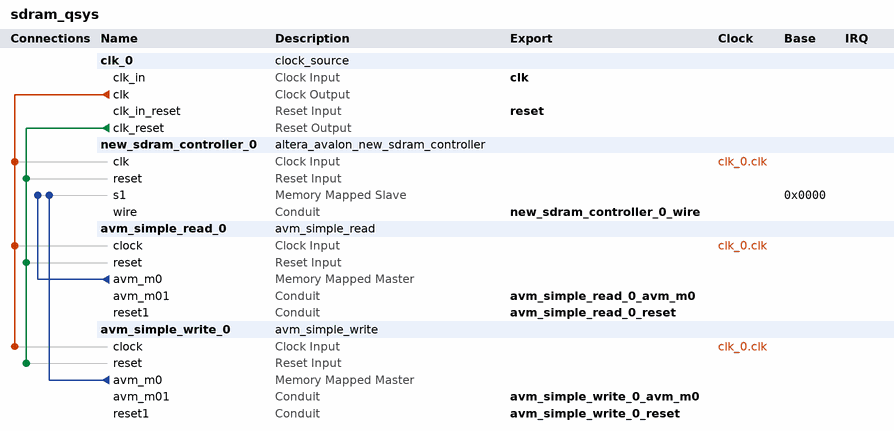
[diagram p0: system contents]
# Platform Designer (Qsys) system sdram_qsys, MAX 10 10M50DAF484C7G
# Parameters at their usual value, and those the tool derives, are not listed.
package require -exact qsys 17.1
create_system sdram_qsys
set_project_property DEVICE_FAMILY {MAX 10}
set_project_property DEVICE 10M50DAF484C7G

add_instance clk_0 clock_source 17.1
set_instance_parameter_value clk_0 clockFrequency 50000000

add_instance new_sdram_controller_0 altera_avalon_new_sdram_controller 17.1
set_instance_parameter_value new_sdram_controller_0 TAC 5.5
set_instance_parameter_value new_sdram_controller_0 TRCD 20.0
set_instance_parameter_value new_sdram_controller_0 TRP 20.0
set_instance_parameter_value new_sdram_controller_0 casLatency 3
set_instance_parameter_value new_sdram_controller_0 columnWidth 10
set_instance_parameter_value new_sdram_controller_0 dataWidth 16
set_instance_parameter_value new_sdram_controller_0 generateSimulationModel false
set_instance_parameter_value new_sdram_controller_0 model single_Micron_MT48LC4M32B2_7_chip
set_instance_parameter_value new_sdram_controller_0 numberOfBanks 4
set_instance_parameter_value new_sdram_controller_0 numberOfChipSelects 1
set_instance_parameter_value new_sdram_controller_0 powerUpDelay 100.0
set_instance_parameter_value new_sdram_controller_0 refreshPeriod 15.625
set_instance_parameter_value new_sdram_controller_0 rowWidth 13

add_instance avm_simple_read_0 avm_simple_read 1.0

add_instance avm_simple_write_0 avm_simple_write 1.0

# connections
add_connection clk_0.clk avm_simple_read_0.clock clock
add_connection clk_0.clk avm_simple_write_0.clock clock
add_connection clk_0.clk new_sdram_controller_0.clk clock
add_connection clk_0.clk_reset avm_simple_read_0.reset reset
add_connection clk_0.clk_reset avm_simple_write_0.reset reset
add_connection clk_0.clk_reset new_sdram_controller_0.reset reset
add_connection avm_simple_read_0.avm_m0 new_sdram_controller_0.s1 avalon
set_connection_parameter_value avm_simple_read_0.avm_m0/new_sdram_controller_0.s1 baseAddress 0x0000
add_connection avm_simple_write_0.avm_m0 new_sdram_controller_0.s1 avalon
set_connection_parameter_value avm_simple_write_0.avm_m0/new_sdram_controller_0.s1 baseAddress 0x0000

# exported interfaces
add_interface avm_simple_read_0_avm_m0 conduit end
set_interface_property avm_simple_read_0_avm_m0 EXPORT_OF avm_simple_read_0.avm_m01
add_interface avm_simple_read_0_reset conduit end
set_interface_property avm_simple_read_0_reset EXPORT_OF avm_simple_read_0.reset1
add_interface avm_simple_write_0_avm_m0 conduit end
set_interface_property avm_simple_write_0_avm_m0 EXPORT_OF avm_simple_write_0.avm_m01
add_interface avm_simple_write_0_reset conduit end
set_interface_property avm_simple_write_0_reset EXPORT_OF avm_simple_write_0.reset1
add_interface clk clock sink
set_interface_property clk EXPORT_OF clk_0.clk_in
add_interface new_sdram_controller_0_wire conduit end
set_interface_property new_sdram_controller_0_wire EXPORT_OF new_sdram_controller_0.wire
add_interface reset reset sink
set_interface_property reset EXPORT_OF clk_0.clk_in_reset

set_interconnect_requirement {$system} qsys_mm.clockCrossingAdapter HANDSHAKE
set_interconnect_requirement {$system} qsys_mm.enableEccProtection FALSE
set_interconnect_requirement {$system} qsys_mm.insertDefaultSlave FALSE
set_interconnect_requirement {$system} qsys_mm.maxAdditionalLatency 1

save_system sdram_qsys.qsys
